# EAGLE design Rocky Switch SSR Shield (EAGLE 8.2.1)
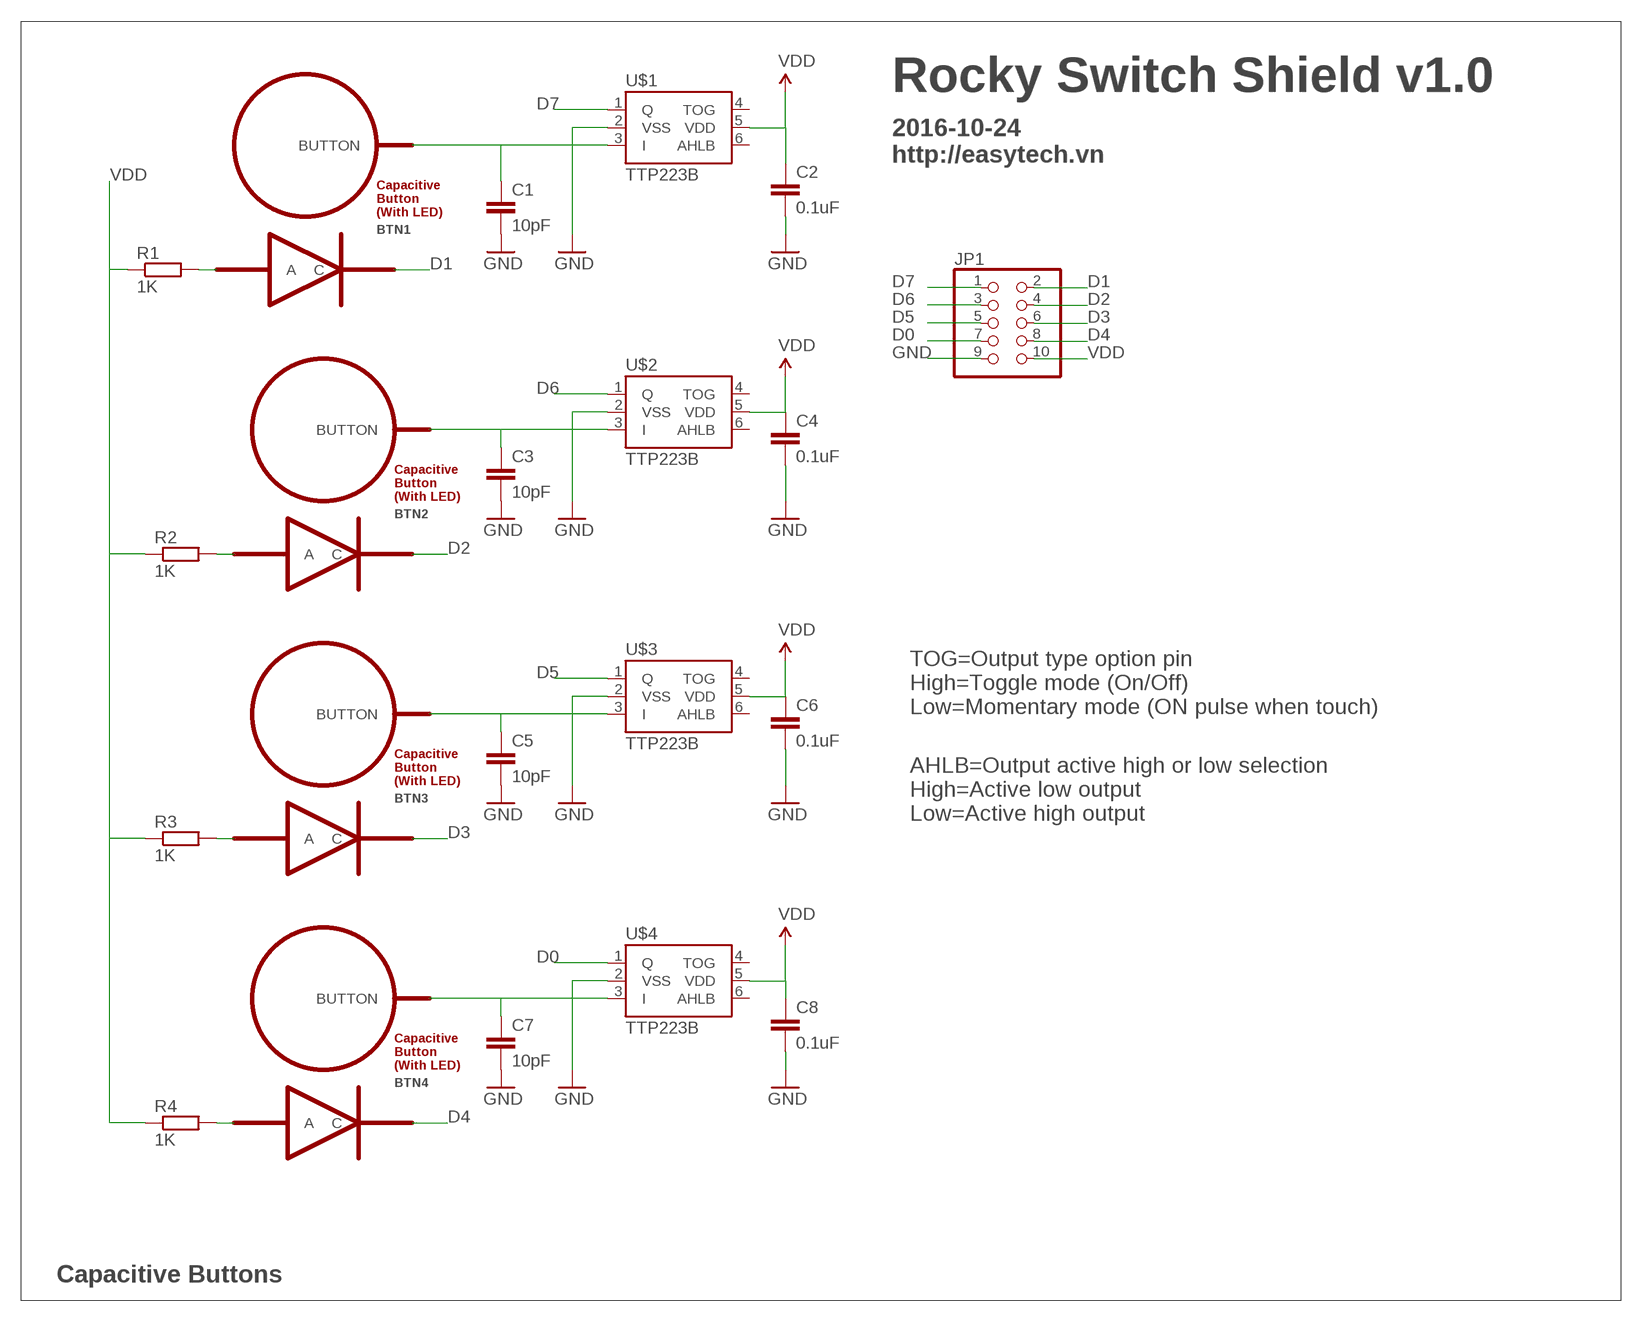
[diagram p0: schematic, sheet 1]

## Parts
BTN1  BUTTON_PASSIVE_LED  [BUTTON_PASSIVE_LED]
BTN2  BUTTON_PASSIVE_LED  [BUTTON_PASSIVE_LED]
BTN3  BUTTON_PASSIVE_LED  [BUTTON_PASSIVE_LED]
BTN4  BUTTON_PASSIVE_LED  [BUTTON_PASSIVE_LED]
C1  10pF  C-EUC0805K  [C0805K]
C2  0.1uF  C-EUC0805K  [C0805K]
C3  10pF  C-EUC0805K  [C0805K]
C4  0.1uF  C-EUC0805K  [C0805K]
C5  10pF  C-EUC0805K  [C0805K]
C6  0.1uF  C-EUC0805K  [C0805K]
C7  10pF  C-EUC0805K  [C0805K]
C8  0.1uF  C-EUC0805K  [C0805K]
JP1  PINHD-2X5  [2X05]
R1  1K  R-EU_R0805  [R0805]
R2  1K  R-EU_R0805  [R0805]
R3  1K  R-EU_R0805  [R0805]
R4  1K  R-EU_R0805  [R0805]
U$1  TTP223B  [SOT23-6]
U$2  TTP223B  [SOT23-6]
U$3  TTP223B  [SOT23-6]
U$4  TTP223B  [SOT23-6]

## Nets
D0: JP1.7 U$4.1(Q)
D1: BTN1.C JP1.2
D2: BTN2.C JP1.4
D3: BTN3.C JP1.6
D4: BTN4.C JP1.8
D5: JP1.5 U$3.1(Q)
D6: JP1.3 U$2.1(Q)
D7: JP1.1 U$1.1(Q)
GND: C1.2 C2.2 C3.2 C4.2 C5.2 C6.2 C7.2 C8.2 JP1.9 U$1.2(VSS) U$2.2(VSS) U$3.2(VSS) U$4.2(VSS)
I1: BTN1.BUTTON C1.1 U$1.3(I)
I2: BTN2.BUTTON C3.1 U$2.3(I)
I3: BTN3.BUTTON C5.1 U$3.3(I)
I4: BTN4.BUTTON C7.1 U$4.3(I)
N$10: BTN1.A R1.2
N$13: BTN2.A R2.2
N$14: BTN3.A R3.2
N$17: BTN4.A R4.2
VDD: C2.1 C4.1 C6.1 C8.1 JP1.10 R1.1 R2.1 R3.1 R4.1 U$1.5(VDD) U$2.5(VDD) U$3.5(VDD) U$4.5(VDD)
Unconnected: U$1.4(TOG) U$1.6(AHLB) U$2.4(TOG) U$2.6(AHLB) U$3.4(TOG) U$3.6(AHLB) U$4.4(TOG) U$4.6(AHLB)

## Notes on the sheet
- Rocky Switch Shield v1.0
- 2016-10-24
  http://easytech.vn
- TOG=Output type option pin
  High=Toggle mode (On/Off)
  Low=Momentary mode (ON pulse when touch)
- AHLB=Output active high or low selection
  High=Active low output
  Low=Active high output
- Capacitive Buttons

## Library data of the parts
BTN1-BTN4 = My Eagle Lib:BUTTON_PASSIVE_LED
C1-C8 = rcl:C-EU: CAPACITOR, European symbol
JP1 = pinhead:PINHD-2X5: PIN HEADER
R1-R4 = rcl:R-EU_: RESISTOR, European symbol
U$1-U$4 = My Eagle Lib:TTP223B

## Board
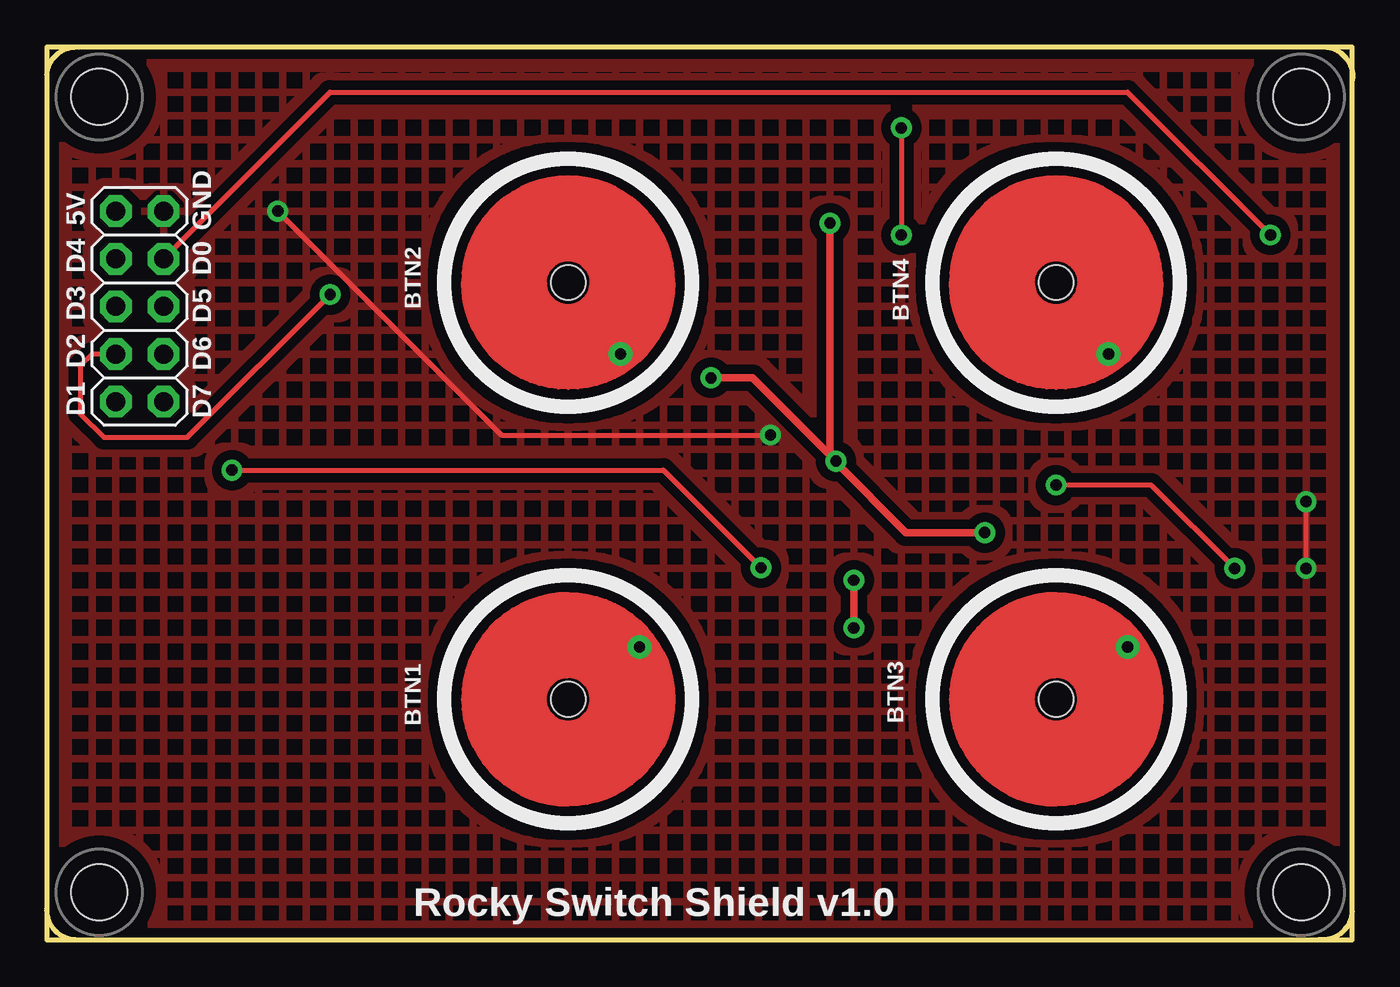
[diagram p1: board, top side]
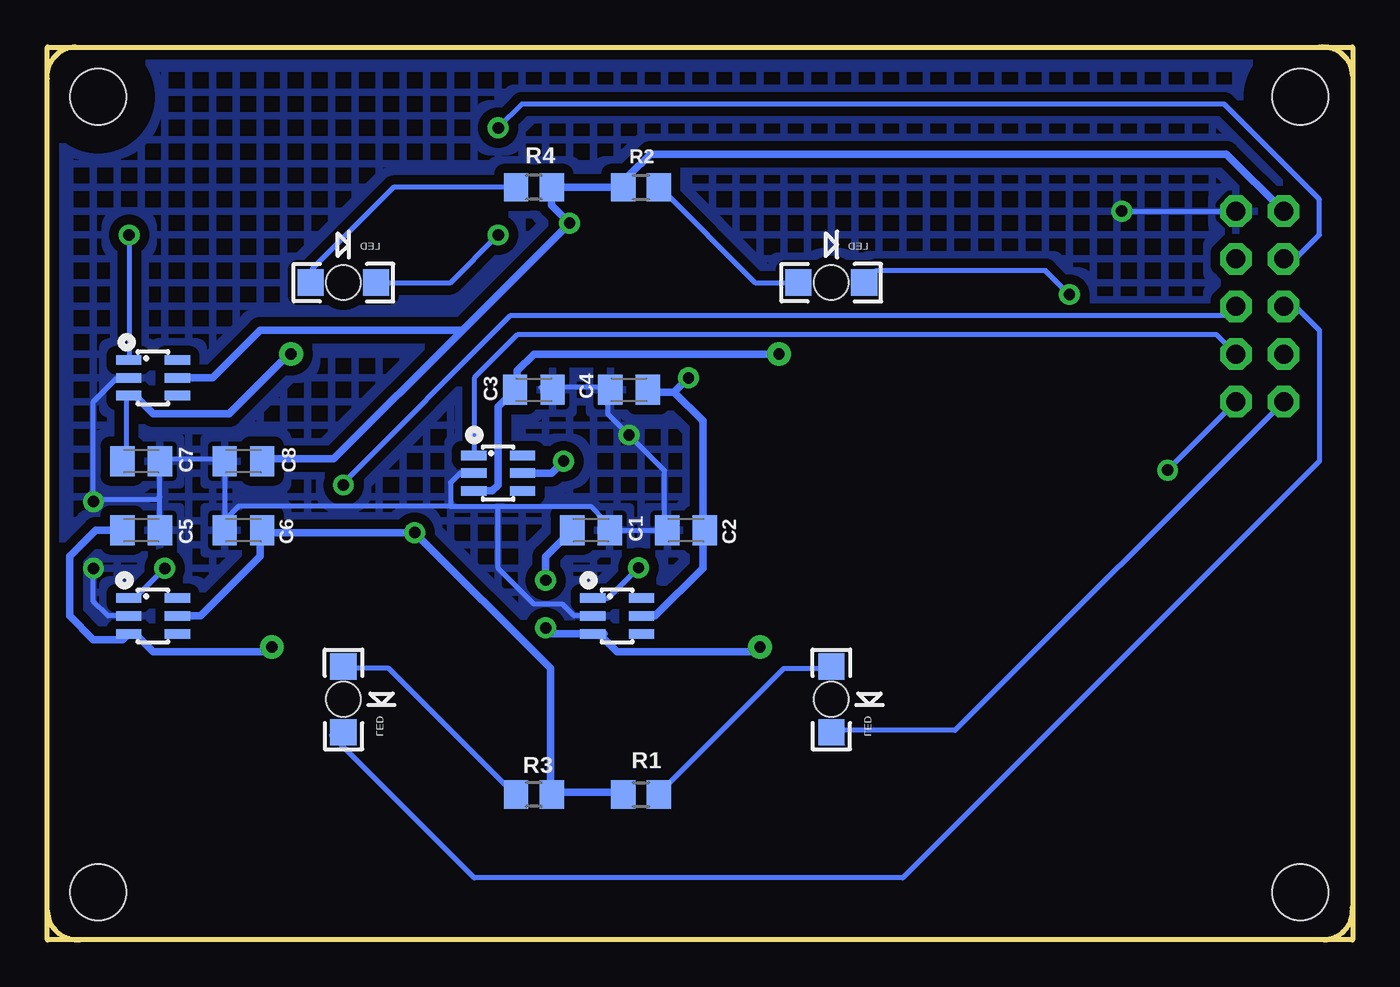
[diagram p2: board, bottom side, seen from below]

Size 69.67 x 47.62 mm. Coordinates in mm from the lower left corner, seen from the top.
Outline: 1.54,0 0,0 0,46.09
Outline: 1.54,0 69.65,0 69.65,47.62 0,47.62 0,46.09
Outline: 68.14,47.62 arc-95 69.66,45.86
Outline: 0,46.09 arc-95 1.77,47.61
Outline: 1.54,0 arc-95 0.01,1.77
Outline: 69.65,1.54 arc-95 67.88,0.01
Copper layers (1*16): Top 0.035mm / dielectric 1.5mm / Bottom 0.035mm
Design rules "default *": minimum track width 10mil, minimum drill 24mil, track to track 10mil, track to pad 10mil, pad to pad 10mil, via to via 10mil, smd to smd 8mil, copper to edge 20mil, drill to drill 12mil, minimum pad ring 13mil, minimum via ring 10mil, stop-mask expansion 4mil, vias tented up to drill 0mil, thermal gap 10mil

### Footprints (pad centres in the part's own frame; a part is rotated, then mirrored left to right if it is on the bottom)
BUTTON_PASSIVE_LED = smd 1.397 x 1.4 bottom: A -1.753,0; C 1.754,0 | drill 0.61: BUTTON -2.794,3.81 | hole 1.854: 0,0
C0805K = smd 1.3 x 1.6: 1 -1,0; 2 1,0
2X05 = drill 1.016 octagon: 1 -5.08,-1.27; 2 -5.08,1.27; 3 -2.54,-1.27; 4 -2.54,1.27; 5 0,-1.27; 6 0,1.27; 7 2.54,-1.27; 8 2.54,1.27; 9 5.08,-1.27; 10 5.08,1.27
R0805 = smd 1.3 x 1.5: 1 -0.95,0; 2 0.95,0
SOT23-6 = smd 0.508 x 1.346: 1 0.95,1.3; 2 0,1.3; 3 -0.95,1.3; 4 -0.95,-1.3; 5 0,-1.3; 6 0.95,-1.3
KFH-M3 = hole 3: 0,0

### Placement (x,y rotation side)
BTN1  27.81,12.83 270 top
BTN2  27.81,35.05 180 top
BTN3  53.85,12.83 270 top
BTN4  53.85,35.05 180 top
C1  40.64,21.84 0 bottom
C2  35.56,21.84 180 bottom
C3  43.69,29.34 0 bottom
C4  38.61,29.34 180 bottom
C5  64.64,21.84 0 bottom
C6  59.18,21.84 180 bottom
C7  64.64,25.53 0 bottom
C8  59.18,25.53 180 bottom
JP1  4.95,33.78 90 top
R1  37.97,7.75 0 bottom
R2  37.97,40.13 0 bottom
R3  43.69,7.75 180 bottom
R4  43.69,40.13 180 bottom
U$1  39.24,17.27 90 bottom
U$2  45.59,24.89 90 bottom
U$3  64.01,17.27 90 bottom
U$4  64.01,29.97 90 bottom
U$6  [KFH-M3]  2.79,2.54 0 top
U$7  [KFH-M3]  66.93,2.54 0 top
U$8  [KFH-M3]  66.93,44.96 0 top
U$9  [KFH-M3]  2.79,44.96 0 top

### Tracks (layer width: path | path; a pad name or v marks a point on that pad's centre or on a via)
D0  (via drill 0.61)
  Top 0.254: JP1.7 15.11,45.21 57.66,45.21 v65.28,37.59
  Bottom 0.254: v65.28,37.59 65.28,30.95 U$4.1
D1
  Bottom 0.254: JP1.2 21.21,11.18 27.81,11.18 BTN1.C
D2  (via drill 0.61)
  Top 0.254: JP1.4 2.41,31.24 1.78,30.61 1.78,28.07 3.05,26.8 7.49,26.8 v15.11,34.42
  Bottom 0.254: v15.11,34.42 16.38,35.69 25.42,35.69 BTN2.C
D3
  Bottom 0.254: JP1.6 3.05,33.78 1.78,32.51 1.78,25.53 24,3.3 46.86,3.3 54.48,10.92 54,10.92 BTN3.C
D4  (via drill 0.61)
  Top 0.254: v45.59,43.31 v45.59,37.59
  Bottom 0.254: JP1.8 3.05,36.32 1.78,37.59 1.78,39.5 6.86,44.58 44.32,44.58 v45.59,43.31 | BTN4.C 48.13,35.05 v45.59,37.59
D5  (via drill 0.61)
  Top 0.254: v53.85,24.26 58.93,24.26 v63.37,19.81
  Bottom 0.254: JP1.5 6.73,33.27 44.96,33.27 53.85,24.38 v53.85,24.26 | U$3.1 65.41,18.29 64.9,18.29 v63.37,19.81
D6
  Bottom 0.254: JP1.3 7.24,32.26 44.58,32.26 46.86,29.97 46.86,25.91 U$2.1
D7  (via drill 0.61)
  Top 0.254: v9.87,25.05 32.89,25.05 v38.1,19.84
  Bottom 0.254: JP1.1 v9.87,25.05 | 40.67,18.23 U$1.1 39.72,18.22 v38.1,19.84
GND  (via drill 0.61)
  Top 0.254: v12.32,38.86 24.26,26.92 v38.61,26.92 | v67.18,19.81 v67.18,23.37
  Bottom 0.254: U$4.2 65.91,29.97 67.18,28.7 67.18,23.49 | 63.63,25.4 C7.2 | C7.2 63.63,25.65 60.32,25.65 C8.2 C6.2 | 39.75,29.46 C4.2 | 43.31,29.46 C3.2 43.2,29.46 39.75,29.46 | C1.2 C2.2 36.7,21.99 36.7,25.02 v38.61,26.92 39.75,28.07 39.75,29.46 | U$2.2 47.62,24.89 48.13,24.38 48.13,23.11 | 39.5,21.84 C1.2 | 60.07,21.84 C6.2 | v12.32,38.86 JP1.9 | 48.13,23.11 59.44,23.11 60.2,22.35 60.2,21.86 C6.2 | C5.2 63.64,23.62 | 63.64,23.62 C7.2 | v67.18,19.81 67.18,18.03 66.42,17.27 U$3.2 | 67.18,23.49 v67.18,23.37 | 67.18,23.49 63.77,23.49 63.64,23.62 | 48.13,23.11 45.59,23.11 | 45.59,23.11 40.64,23.11 39.88,22.35 39.88,22.08 C1.2 | 45.59,23.11 45.59,19.81 43.69,17.91 42.16,17.91 41.53,17.27 U$1.2
  pour Bottom (isolate 0.508, hatched): 79.88,52.83 -6.73,52.07 -6.73,-7.62 79.88,-6.86
  pour Top (isolate 0.508, hatched): 79.88,52.83 -6.73,52.07 -6.73,-7.62 79.88,-6.86
I1  (via drill 0.61)
  Top 0.406: v43.05,16.64 v43.05,19.18
  Bottom 0.254: 41.53,21.84 C1.1 | 31.62,15.49 BTN1.BUTTON | U$1.3 39.94,16.32
  Bottom 0.406: 31.62,15.49 31.75,15.37 39.24,15.37 40.2,16.32 U$1.3 | 39.94,16.32 42.74,16.32 v43.05,16.64 | v43.05,19.18 43.05,20.43 C1.1
I2
  Bottom 0.254: 45.09,29.46 C3.1
  Bottom 0.406: BTN2.BUTTON 43.69,31.24 44.58,30.35 44.58,29.45 C3.1 45.59,28.43 45.59,24.26 45.91,23.94 U$2.3
I3
  Bottom 0.254: 65.15,16.26 U$3.3
  Bottom 0.406: BTN3.BUTTON 57.91,15.37 64.01,15.37 64.96,16.32 U$3.3 65.63,16 67.18,16 68.45,17.27 68.45,20.45 67.06,21.84 C5.1
I4
  Bottom 0.254: U$4.3 65.41,28.96 65.41,25.65 C7.1 | BTN4.BUTTON 56.71,31.24 56.77,31.24
  Bottom 0.406: 56.77,31.24 59.94,28.07 64.01,28.07 64.96,29.02 U$4.3
N$10
  Bottom 0.254: BTN1.A 27.81,14.48 30.35,14.48 36.96,7.87 R1.2
N$13
  Bottom 0.254: BTN2.A 31.88,35.05 36.96,40.13 R2.2
N$14
  Bottom 0.254: BTN3.A 53.72,14.48 51.43,14.48 44.83,7.87 R3.2
N$17
  Bottom 0.254: R4.2 51.18,40.13 55.5,35.81 55.5,35.05 BTN4.A
VDD  (via drill 0.61)
  Top 0.406: v41.78,38.23 41.78,25.85 v42.1,25.53 | v42.1,25.53 42.1,25.46 45.85,21.72 v50.04,21.72 | v35.43,29.97 37.66,29.97 v42.1,25.53
  Bottom 0.254: 58.04,25.65 C8.1 | 38.99,40.13 R2.1 | 37.72,29.21 C4.1 | 38.99,7.87 R1.1 38.73,7.87 | 42.55,7.87 R3.1 42.8,7.87 | 37.21,17.27 U$1.5 | 34.67,21.84 C2.1
  Bottom 0.406: JP1.10 6.73,41.91 37.46,41.91 38.61,40.77 38.61,40.45 R2.1 R4.1 | 42.55,7.87 38.99,7.87 | 37.21,17.27 34.67,19.81 34.67,21.84 34.67,27.69 36.2,29.21 | 42.8,40.13 R4.1 | R4.1 42.74,39.18 v41.78,38.23 47.5,32.51 | U$2.5 42.74,24.89 v42.1,25.53 | 37.72,29.21 36.2,29.21 | 36.2,29.21 v35.43,29.97 | U$4.5 60.83,29.97 58.29,32.51 47.5,32.51 | 58.04,25.65 54.36,25.65 47.5,32.51 | U$3.5 61.47,17.27 58.29,20.45 58.29,21.73 C6.1 57.78,21.84 57.66,21.72 v50.04,21.72 42.8,14.48 42.8,7.87

### Text on the board
tNames: 5V | GND | D4 | D0 | D3 | D5 | D2 | D6 | D1 | D7 | Rocky Switch Shield v1.0